# Altium project StacjaPogodowa.PrjPcb
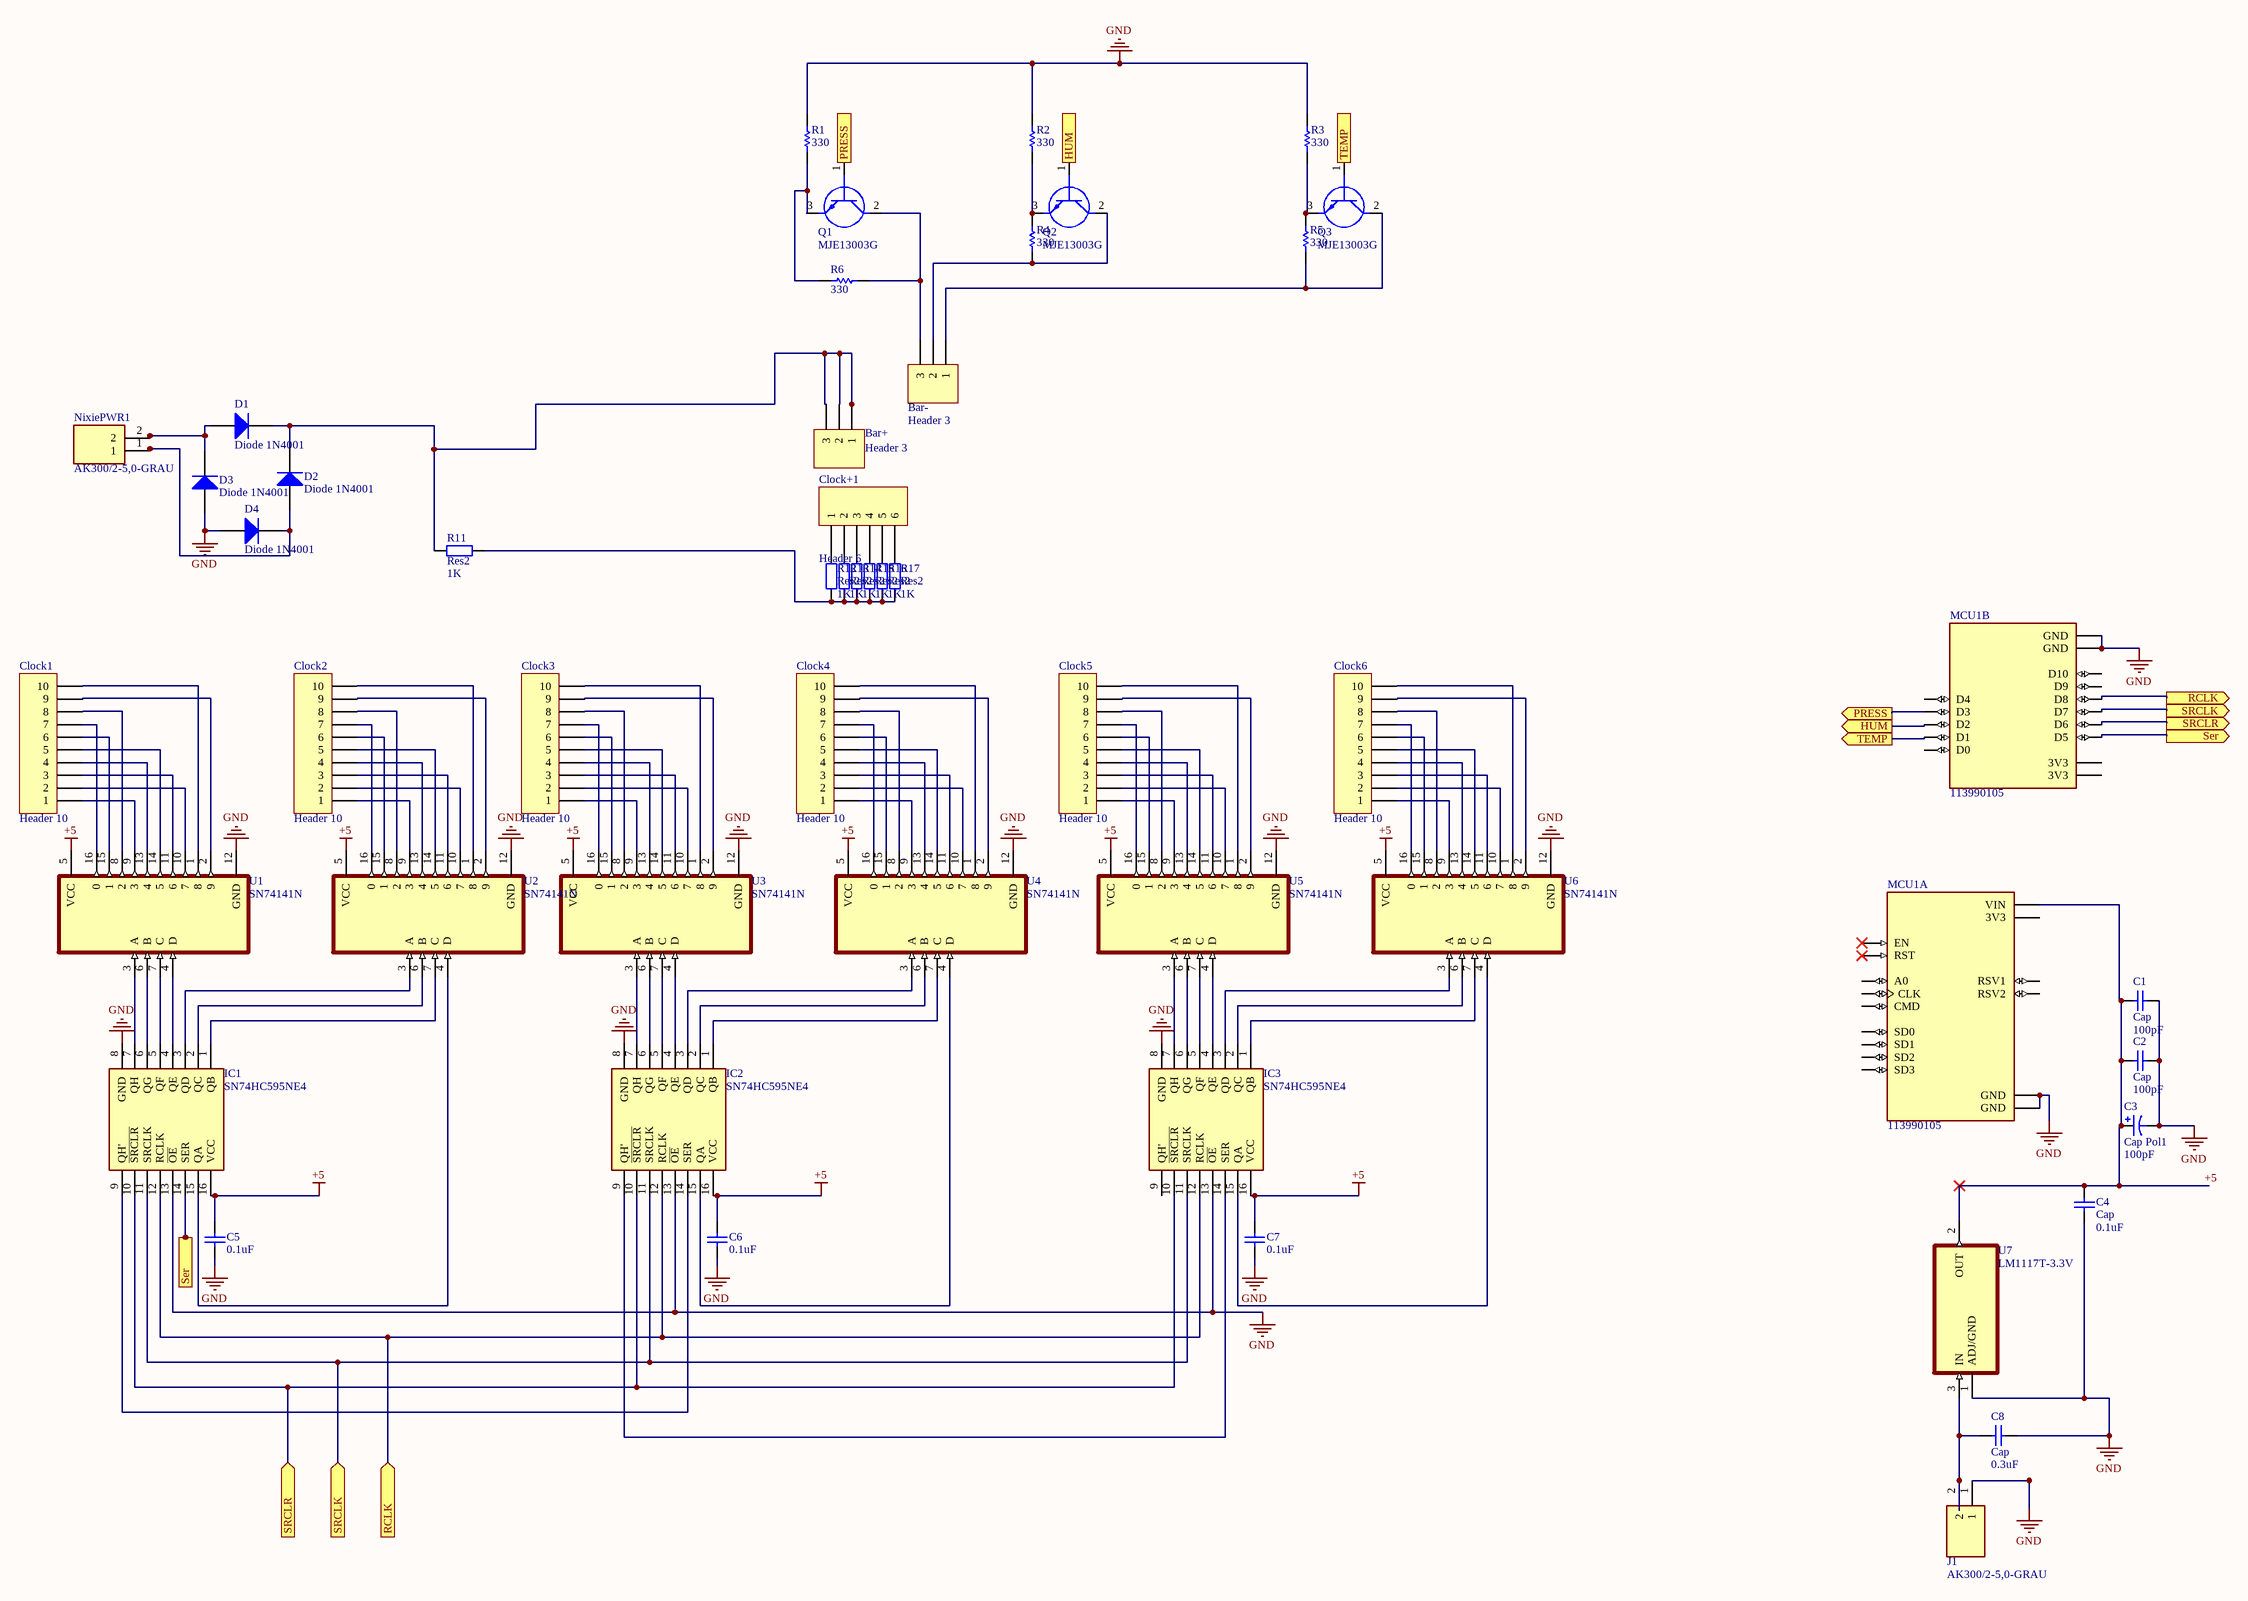
[diagram p0: main.SchDoc]
1 sheet, 50 parts. Net scope: flat (ports and power ports of the same name join across sheets).
Board file: main.PcbDoc

## Sheet main.SchDoc
size A2

### Parts
Bar+  Header 3  [HDR1X3]
Bar-  Header 3  [HDR1X3]
C1  Cap  value 100pF  [AXIAL-0.3]
C2  Cap  value 100pF  [AXIAL-0.3]
C3  Cap Pol1  value 100pF  [CAPR5-4X5]
C4  Cap  value 0.1uF  [AXIAL-0.3]
C5  value 0.1uF  [AXIAL-0.3]  (hidden comment: Cap)
C6  value 0.1uF  [AXIAL-0.3]  (hidden comment: Cap)
C7  value 0.1uF  [AXIAL-0.3]  (hidden comment: Cap)
C8  Cap  value 0.3uF  [AXIAL-0.3]
Clock1  Header 10  [HDR1X10]
Clock2  Header 10  [HDR1X10]
Clock3  Header 10  [HDR1X10]
Clock4  Header 10  [HDR1X10]
Clock5  Header 10  [HDR1X10]
Clock6  Header 10  [HDR1X10]
Clock+1  Header 6  [HDR1X6]
D1  Diode 1N4001  [DO-41]
D2  Diode 1N4001  [DO-41]
D3  Diode 1N4001  [DO-41]
D4  Diode 1N4001  [DO-41]
IC1  SN74HC595NE4  [DIP794W53P254L1930H508Q16N]
IC2  SN74HC595NE4  [DIP794W53P254L1930H508Q16N]
IC3  SN74HC595NE4  [DIP794W53P254L1930H508Q16N]
J1  AK300/2-5,0-GRAU  [*PTR_AK300/2-5,0-GRAU]
MCU1  113990105  [*SEEED_113990105_113990105(Primary)]  (parts A,B of 2)
NixiePWR1  AK300/2-5,0-GRAU  [*PTR_AK300/2-5,0-GRAU]
Q1  MJE13003G  [TO229P300X760X1364-3P]
Q2  MJE13003G  [TO229P300X760X1364-3P]
Q3  MJE13003G  [TO229P300X760X1364-3P]
R1  330  [AXIAL-0.3]
R2  330  [AXIAL-0.3]
R3  330  [AXIAL-0.3]
R4  330  [AXIAL-0.3]
R5  330  [AXIAL-0.3]
R6  330  [AXIAL-0.3]
R11  Res2  value 1K  [AXIAL-0.4]
R12  Res2  value 1K  [AXIAL-0.4]
R13  Res2  value 1K  [AXIAL-0.4]
R14  Res2  value 1K  [AXIAL-0.4]
R15  Res2  value 1K  [AXIAL-0.4]
R16  Res2  value 1K  [AXIAL-0.4]
R17  Res2  value 1K  [AXIAL-0.4]
U1  SN74141N  [*DIP762W46P254L2134H508Q16]
U2  SN74141N  [*DIP762W46P254L2134H508Q16]
U3  SN74141N  [*DIP762W46P254L2134H508Q16]
U4  SN74141N  [*DIP762W46P254L2134H508Q16]
U5  SN74141N  [*DIP762W46P254L2134H508Q16]
U6  SN74141N  [*DIP762W46P254L2134H508Q16]
U7  LM1117T-3.3V  [*TO254P470X1016X2222-3P]

### Ports
HUM (in), HUM (out), PRESS (in), PRESS (out), RCLK (in), RCLK (out), Ser (in), Ser (out), SRCLK (in), SRCLK (out), SRCLR (in), SRCLR (out), TEMP (in), TEMP (out)

### Nets
+5: C1.1 C2.1 C3.1 C4.2 C5.2 C6.2 C7.2 IC1.16(VCC) IC2.16(VCC) IC3.16(VCC) MCU1.J1_15(VIN) U1.5(VCC) U2.5(VCC) U3.5(VCC) U4.5(VCC) U5.5(VCC) U6.5(VCC) U7.2(OUT)
GND: C1.2 C2.2 C3.2 C4.1 C5.1 C6.1 C7.1 C8.1 D3.1(A) D4.1(A) IC1.8(GND) IC1.13(~{OE}) IC2.8(GND) IC2.13(~{OE}) IC3.8(GND) IC3.13(~{OE}) J1.1 MCU1.J1_10(GND) MCU1.J1_14(GND) MCU1.J2_7(GND) MCU1.J2_14(GND) R1.2 R2.2 R3.2 U1.12(GND) U2.12(GND) U3.12(GND) U4.12(GND) U5.12(GND) U6.12(GND) U7.1(ADJ/GND)
NetBar+_1: Bar+.1 Bar+.2 Bar+.3 D1.2(K) D2.2(K) R11.1
NetBar-_1: Bar-.1 Q3.2(C) R5.1
NetBar-_2: Bar-.2 Q2.2(C) R4.1
NetBar-_3: Bar-.3 Q1.2(C) R6.1
NetC8_2: C8.2 J1.2 U7.3(IN)
NetClock1_1: Clock1.1 U1.9(3)
NetClock1_2: Clock1.2 U1.10(7)
NetClock1_3: Clock1.3 U1.11(6)
NetClock1_4: Clock1.4 U1.13(4)
NetClock1_5: Clock1.5 U1.14(5)
NetClock1_6: Clock1.6 U1.15(1)
NetClock1_7: Clock1.7 U1.16(0)
NetClock1_8: Clock1.8 U1.8(2)
NetClock1_9: Clock1.9 U1.2(9)
NetClock1_10: Clock1.10 U1.1(8)
NetClock2_1: Clock2.1 U2.9(3)
NetClock2_2: Clock2.2 U2.10(7)
NetClock2_3: Clock2.3 U2.11(6)
NetClock2_4: Clock2.4 U2.13(4)
NetClock2_5: Clock2.5 U2.14(5)
NetClock2_6: Clock2.6 U2.15(1)
NetClock2_7: Clock2.7 U2.16(0)
NetClock2_8: Clock2.8 U2.8(2)
NetClock2_9: Clock2.9 U2.2(9)
NetClock2_10: Clock2.10 U2.1(8)
NetClock3_1: Clock3.1 U3.9(3)
NetClock3_2: Clock3.2 U3.10(7)
NetClock3_3: Clock3.3 U3.11(6)
NetClock3_4: Clock3.4 U3.13(4)
NetClock3_5: Clock3.5 U3.14(5)
NetClock3_6: Clock3.6 U3.15(1)
NetClock3_7: Clock3.7 U3.16(0)
NetClock3_8: Clock3.8 U3.8(2)
NetClock3_9: Clock3.9 U3.2(9)
NetClock3_10: Clock3.10 U3.1(8)
NetClock4_1: Clock4.1 U4.9(3)
NetClock4_2: Clock4.2 U4.10(7)
NetClock4_3: Clock4.3 U4.11(6)
NetClock4_4: Clock4.4 U4.13(4)
NetClock4_5: Clock4.5 U4.14(5)
NetClock4_6: Clock4.6 U4.15(1)
NetClock4_7: Clock4.7 U4.16(0)
NetClock4_8: Clock4.8 U4.8(2)
NetClock4_9: Clock4.9 U4.2(9)
NetClock4_10: Clock4.10 U4.1(8)
NetClock5_1: Clock5.1 U5.9(3)
NetClock5_2: Clock5.2 U5.10(7)
NetClock5_3: Clock5.3 U5.11(6)
NetClock5_4: Clock5.4 U5.13(4)
NetClock5_5: Clock5.5 U5.14(5)
NetClock5_6: Clock5.6 U5.15(1)
NetClock5_7: Clock5.7 U5.16(0)
NetClock5_8: Clock5.8 U5.8(2)
NetClock5_9: Clock5.9 U5.2(9)
NetClock5_10: Clock5.10 U5.1(8)
NetClock6_1: Clock6.1 U6.9(3)
NetClock6_2: Clock6.2 U6.10(7)
NetClock6_3: Clock6.3 U6.11(6)
NetClock6_4: Clock6.4 U6.13(4)
NetClock6_5: Clock6.5 U6.14(5)
NetClock6_6: Clock6.6 U6.15(1)
NetClock6_7: Clock6.7 U6.16(0)
NetClock6_8: Clock6.8 U6.8(2)
NetClock6_9: Clock6.9 U6.2(9)
NetClock6_10: Clock6.10 U6.1(8)
NetClock+1_1: Clock+1.1 R12.2
NetClock+1_2: Clock+1.2 R13.2
NetClock+1_3: Clock+1.3 R14.2
NetClock+1_4: Clock+1.4 R15.2
NetClock+1_5: Clock+1.5 R16.2
NetClock+1_6: Clock+1.6 R17.2
NetD1_1: D1.1(A) D3.2(K) NixiePWR1.2
NetD2_1: D2.1(A) D4.2(K) NixiePWR1.1
NetIC1_1: IC1.1(QB) U2.7(C)
NetIC1_2: IC1.2(QC) U2.6(B)
NetIC1_3: IC1.3(QD) U2.3(A)
NetIC1_4: IC1.4(QE) U1.4(D)
NetIC1_5: IC1.5(QF) U1.7(C)
NetIC1_6: IC1.6(QG) U1.6(B)
NetIC1_7: IC1.7(QH) U1.3(A)
NetIC1_9: IC1.9(QH') IC2.14(SER)
NetIC1_10: IC1.10(~{SRCLR}) IC2.10(~{SRCLR}) IC3.10(~{SRCLR}) MCU1.J2_9(D6) ; port SRCLR
NetIC1_11: IC1.11(SRCLK) IC2.11(SRCLK) IC3.11(SRCLK) MCU1.J2_10(D7) ; port SRCLK
NetIC1_12: IC1.12(RCLK) IC2.12(RCLK) IC3.12(RCLK) MCU1.J2_11(D8) ; port RCLK
NetIC1_14: IC1.14(SER) MCU1.J2_8(D5) ; port Ser
NetIC1_15: IC1.15(QA) U2.4(D)
NetIC2_1: IC2.1(QB) U4.7(C)
NetIC2_2: IC2.2(QC) U4.6(B)
NetIC2_3: IC2.3(QD) U4.3(A)
NetIC2_4: IC2.4(QE) U3.4(D)
NetIC2_5: IC2.5(QF) U3.7(C)
NetIC2_6: IC2.6(QG) U3.6(B)
NetIC2_7: IC2.7(QH) U3.3(A)
NetIC2_9: IC2.9(QH') IC3.14(SER)
NetIC2_15: IC2.15(QA) U4.4(D)
NetIC3_1: IC3.1(QB) U6.7(C)
NetIC3_2: IC3.2(QC) U6.6(B)
NetIC3_3: IC3.3(QD) U6.3(A)
NetIC3_4: IC3.4(QE) U5.4(D)
NetIC3_5: IC3.5(QF) U5.7(C)
NetIC3_6: IC3.6(QG) U5.6(B)
NetIC3_7: IC3.7(QH) U5.3(A)
NetIC3_15: IC3.15(QA) U6.4(D)
NetMCU1_J2_2: MCU1.J2_2(D1) Q3.1(B) ; port TEMP
NetMCU1_J2_3: MCU1.J2_3(D2) Q2.1(B) ; port HUM
NetMCU1_J2_4: MCU1.J2_4(D3) Q1.1(B) ; port PRESS
NetQ1_3: Q1.3(E) R1.1 R6.2
NetQ2_3: Q2.3(E) R2.1 R4.2
NetQ3_3: Q3.3(E) R3.1 R5.2
NetR11_2: R11.2 R12.1 R13.1 R14.1 R15.1 R16.1 R17.1

Not connected (* = marked no-connect by the designer): IC3 9(QH'); MCU1 J1_1(A0) J1_2(RSV1) J1_3(RSV2) J1_4(SD3) J1_5(SD2) J1_6(SD1) J1_7(CMD) J1_8(SD0) J1_9(CLK) J1_11(3V3) J1_12(EN)* J1_13(RST)* J2_1(D0) J2_5(D4) J2_6(3V3) J2_12(D9) J2_13(D10) J2_15(3V3)

### Library data of the parts
Bar+ Bar- = Header 3: Header, 3-Pin; LatestRevisionDate: 17-Jul-2002; LatestRevisionNote: Re-released for DXP Platform.; Publisher: Altium Limited
C1 C2 C4-C8 = Cap: Capacitor; Published: 8-Jun-2000; LatestRevisionDate: 17-Jul-2002; LatestRevisionNote: Re-released for DXP Platform.; PackageReference: RAD-0.3; Publisher: Altium Limited; PackageDescription: Radial Cap, Thru-Hole; 2 Leads; 0.3 in Pin Spacing
C3 = Cap Pol1: Polarized Capacitor (Radial); Published: 8-Jun-2000; LatestRevisionDate: 17-Jul-2002; LatestRevisionNote: Re-released for DXP Platform.; PackageReference: RB7.6-15; Publisher: Altium Limited; PackageDescription: Polarized Capacitor (Radial); 2 Leads
Clock1-Clock6 = Header 10: Header, 10-Pin; LatestRevisionDate: 17-Jul-2002; LatestRevisionNote: Re-released for DXP Platform.; Publisher: Altium Limited
Clock+1 = Header 6: Header, 6-Pin; LatestRevisionDate: 17-Jul-2002; LatestRevisionNote: Re-released for DXP Platform.; Publisher: Altium Limited
D1-D4 = Diode 1N4001: 1 Amp General Purpose Rectifier; Published: 8-Jun-2000; LatestRevisionDate: 17-Jul-2002; LatestRevisionNote: Re-released for DXP Platform.; DatasheetVersion: 1998; PackageVersion: Aug-1999; PackageReference: DO-41; Publisher: Altium Limited; PackageDescription: Diode, Axial; Body 5.2 x 2.7 mm (LxDia. max), Lead Dia. 0.86 mm (max); Code_JEDEC: DO-204-AL; ComponentLink1Description: Manufacturer Link; ComponentLink1URL: http://www.fairchildsemi.com/; ComponentLink2Description: Datasheet; ComponentLink2URL: http://www.fairchildsemi.com/ds/1N%2F1N4001.pdf
IC1-IC3 = SN74HC595NE4: Integrated Circuit; Manufacturer_Name: Texas Instruments; Datasheet Link: http://www.ti.com/lit/ds/symlink/sn74hc595.pdf; Height: 5.08mm; Manufacturer_Part_Number: SN74HC595NE4; Mouser Part Number: 595-SN74HC595NE4; Mouser Price/Stock: https://www.mouser.com/Search/Refine.aspx?Keyword=595-SN74HC595NE4
J1 NixiePWR1 = AK300/2-5,0-GRAU: Terminal block; 5mm; angled 45Â°; ways: 2; MF: PTR Messtechnik; Value: *; SnapEDA_Link: https://www.snapeda.com/parts/AK300/2-5%2C0-GRAU/PTR%20Messtechnik/view-part/556894/?ref=snap; Package: None; MP: AK300/2-5,0-GRAU; Availability: Unavailable; Price: None
MCU1 = 113990105: An open-source firmware and development kit that helps you to Prototype your IOT product within a few Lua script lines; MP: NodeMCU v2; MF: Seeed Technology; Availability: Unavailable; SnapEDA_Link: https://www.snapeda.com/parts/NodeMCU%20v2/Seeed%20Technology%20Co.%2C%20Ltd/view-part/378076/?ref=snap; Price: None; Value: *; Package: None
Q1-Q3 = MJE13003G: Transistor BJT NPN; Manufacturer_Name: ON Semiconductor; Datasheet Link: https://www.onsemi.com/pub/Collateral/MJE13003-D.PDF; Height: 3mm; Manufacturer_Part_Number: MJE13003G; Mouser Part Number: 863-MJE13003G; Mouser Price/Stock: https://www.mouser.com/Search/Refine.aspx?Keyword=863-MJE13003G
R1-R6 = Res1: Resistor; Published: 8-Jun-2000; LatestRevisionDate: 17-Jul-2002; LatestRevisionNote: Re-released for DXP Platform.; PackageReference: AXIAL-0.3; Publisher: Altium Limited; PackageDescription: Axial Device, Thru-Hole; 2 Leads; 0.3 in Pin Spacing; Value: 330
R11-R17 = Res2: Resistor; Published: 8-Jun-2000; LatestRevisionDate: 17-Jul-2002; LatestRevisionNote: Re-released for DXP Platform.; PackageReference: AXIAL-0.4; Publisher: Altium Limited; PackageDescription: Axial Device, Thru-Hole; 2 Leads; 0.4 in Pin Spacing
U1-U6 = SN74141N: BCD to DECIMAL Decoder/Driver; MF: Texas Instruments; Package: None; Price: None; SnapEDA_Link: https://www.snapeda.com/parts/SN74141N/Texas%20Instruments/view-part/454163/?ref=snap; Availability: Unavailable; Value: *; MP: SN74141N
U7 = LM1117T-5.0: Linear Voltage Regulator IC 1 Output 800mA TO-220-3; MF: Texas Instruments; MP: LM1117T50; Price: None; Value: *; Package: None; Availability: Unavailable; SnapEDA_Link: https://www.snapeda.com/parts/LM1117T50/Texas%20Instruments/view-part/53993/?ref=snap